# Altium schematic sheet proy_10B_SCH_1_v1i1.SchDoc
size A
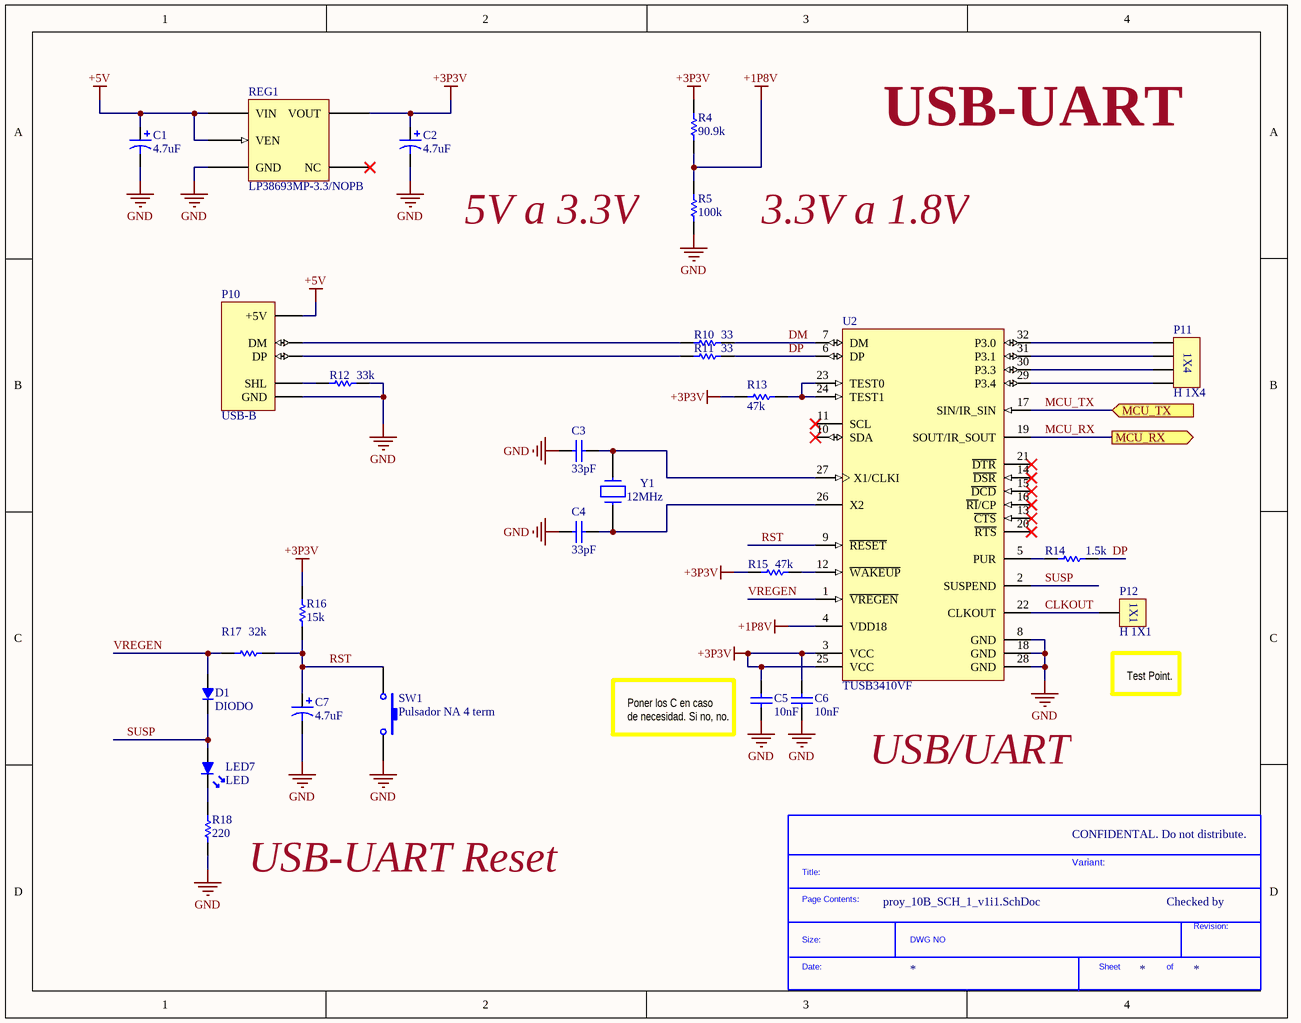
[diagram p0: proy_10B_SCH_1_v1i1.SchDoc]

## Parts
*  SDTitleBlock  (value not drawn)  (graphical)
C1  4.7uF  [C 6.3x11]
C2  4.7uF  [C 6.3x11]
C3  33pF  [C 1206]
C4  33pF  [C 1206]
C5  10nF  [C 1206]
C6  10nF  [C 1206]
C7  4.7uF  [C 6.3x11]
D1  DIODO  [D 1206]
LED7  LED  [LED 1206]
P10  USB-B  [USBB]
P11  H 1X4  [H 1X4 - Hembra]
P12  H 1X1  [H 1x1]
R4  90.9k  [R 1206]
R5  100k  [R 1206]
R10  33  [R 1206]
R11  33  [R 1206]
R12  33k  [R 1206]
R13  47k  [R 1206]
R14  1.5k  [R 1206]
R15  47k  [R 1206]
R16  15k  [R 1206]
R17  32k  [R 1206]
R18  220  [R 1206]
REG1  LP38693MP-3.3/NOPB  [SOT223-5]
SW1  Pulsador NA 4 term  [TACT SW]
U2  TUSB3410VF  [TQFP-32]
Y1  12MHz  [Y TRHU]

## Ports
MCU_RX (out), MCU_TX (in)

## Nets
+1P8V: R4.2 R5.1 U2.4(VDD18)
+3P3V: C2.1 C5.2 C6.2 R4.1 R13.2 R15.2 R16.1 REG1.3(VOUT) U2.3(VCC) U2.25(VCC)
+5V: C1.1 P10.1(+5V) REG1.1(VEN) REG1.4(VIN)
GND: C1.2 C2.2 C3.1 C4.1 C5.1 C6.1 C7.2 P10.4(GND) R5.2 R12.1 R18.2 REG1.0(GND) SW1.2 U2.8(GND) U2.18(GND) U2.28(GND)
CLKOUT: P12.1 U2.22(CLKOUT)
DM: R10.1 U2.7(DM)
DP: R11.1 R14.1 U2.6(DP)
MCU_RX: U2.19(SOUT/IR_SOUT) ; port MCU_RX
MCU_TX: U2.17(SIN/IR_SIN) ; port MCU_TX
RST: C7.1 R16.2 R17.1 SW1.1 U2.9(~{RESET})
SUSP: D1.2(K) LED7.1(A) U2.2(SUSPEND)
VREGEN: D1.1(A) R17.2 U2.1(~{VREGEN})
NetC3_2: C3.2 U2.27(X1/CLKI) Y1.2
NetC4_2: C4.2 U2.26(X2) Y1.1
NetLED7_2: LED7.2(K) R18.1
NetP10_0: P10.0(SHL) R12.2
NetP10_2: P10.2(DM) R10.2
NetP10_3: P10.3(DP) R11.2
NetP11_1: P11.1 U2.32(P3.0)
NetP11_2: P11.2 U2.31(P3.1)
NetP11_3: P11.3 U2.30(P3.3)
NetP11_4: P11.4 U2.29(P3.4)
NetR13_1: R13.1 U2.23(TEST0) U2.24(TEST1)
NetR14_2: R14.2 U2.5(PUR)
NetR15_1: R15.1 U2.12(~{WAKEUP})

Not connected (* = marked no-connect by the designer): REG1 2(NC)*; U2 10(SDA)* 11(SCL)* 13(~{CTS})* 14(~{DSR})* 15(~{DCD})* 16(~{RI}/CP)* 20(~{RTS})* 21(~{DTR})*

## Notes on the sheet
- USB-UART
- (near R5) 5V a 3.3V
- 3.3V a 1.8V
- Test Point.
- (near C5) Poner los C en caso
  de necesidad. Si no, no.
- USB/UART
- CONFIDENTAL. Do not distribute.
- (near R18) USB-UART Reset
- Variant:
- Checked by
- (in symbol H 1X1) 1X1
- (in symbol H 1X4) 1X4
- (in symbol SDTitleBlock) Title:; Page Contents:; Revision:; Size:; DWG NO; Date:; Sheet; of

## Library data of the parts
C1 C2 C7 = C POL: Capacitor polarizado.; .Creator: SR
C3-C6 = C: Capacitor; .PCBCheck: Used; .Creator: SR; .SCHCheck: Used; Category: Capacitores
D1 = DIODO: .Creator: SR; .PCBCheck: SR; .SCHCheck: SR
LED7 = LED: .Creator: SR; .PCBCheck: Used; .SCHCheck: Used
P10 = USB-B: Conector USB tipo B
P11 = H 1X4: PIN HEADER 1X4; .Creator: SR; .PCBCheck: Used; .SCHCheck: Used
P12 = H 1X1: PIN HEADER 1X1; .Creator: SR; .PCBCheck: Used; .SCHCheck: Used
R4 R5 R10-R18 = R: Resistencia; .Creator: SR; .PCBCheck: Used; .SCHCheck: Used; Category: Resistencias
REG1 = LP38693MP-3.3/NOPB: IC REG LDO 3.3V 0.5A SOT223-5; Manufacturer: Texas Instruments; Regulator Topology: Positive Fixed; Current - Output: 500mA; Voltage - Dropout (Typical): 0.33V @ 500mA; Number of Regulators: 1; Voltage - Input: Up to 10V; Supplier 1: Digi-Key; Manufacturer Part Number: LP38693MP-3.3/NOPB; RoHS: RoHS Compliant; Category: Integrated Circuits (ICs); Stock 1: 6815; Pricing 1: 1=1.62, 10=1.436, 25=1.296, 100=1.134, 250=0.99452, 500=0.882, 750=0.76951, 1000=0.5625 (USD); Packaging: Cut Tape (CT); Voltage - Output: 3.3V; Current - Limit (Min): -; Operating Temperature: -40°C ~ 125°C; Mounting Type: Surface Mount; Package / Case: TO-261-5, TO-261AB; Supplier Device Package: SOT-223-5; ComponentLink1URL: http://www.ti.com/lit/ds/symlink/lp38691.pdf; ComponentLink1Description: http://www.ti.com/lit/ds/symlink/lp38691.pdf; Supplier Part Number 1: LP38693MP-3.3/NOPBCT-ND
SW1 = Pulsador NA 4 term: .Creator: G; .PCBCheck: G; .SCHCheck: G
U2 = TUSB3410VF: IC CONV SERIAL-TO-USB 32-LQFP; Manufacturer: Texas Instruments; Core Processor: 8052; Program Memory Type: ROM (10 kB); Controller Series: TUSB; RAM Size: 18K x 8; Interface: I²C, USB, UART; Number of I/O: 4; Voltage - Supply: 3 V ~ 3.6 V; Supplier 1: Digi-Key; Manufacturer Part Number: TUSB3410VF; RoHS: RoHS Compliant; Category: Integrated Circuits (ICs); Stock 1: 679; Pricing 1: 1=6.8, 10=6.075, 25=5.4676, 100=4.9815, 250=4.49552, 500=4.0338, 750=3.645, 1000=3.0375 (USD); Packaging: Tray; Applications: USB Serial Port Controller; Operating Temperature: 0°C ~ 70°C; Mounting Type: Surface Mount; Package / Case: 32-LQFP; Supplier Device Package: 32-LQFP (7x7); ComponentLink1URL: http://www.ti.com/lit/ds/symlink/tusb3410.pdf; ComponentLink1Description: http://www.ti.com/lit/ds/symlink/tusb3410.pdf; Supplier Part Number 1: 296-12699-ND
Y1 = Cristal de Cuarzo: .Creator: G; .PCBCheck: Used; .SCHCheck: Used